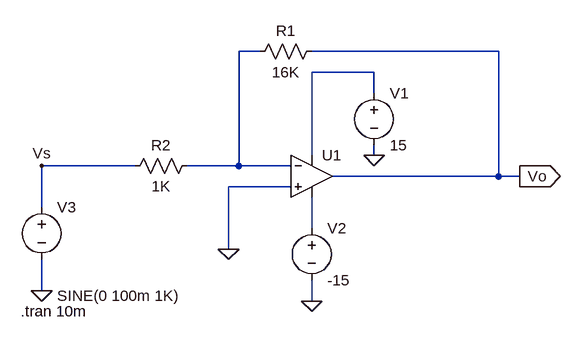
[diagram p0: schematic Run_1_A.asc]
Run_1_A.asc, the LTspice schematic file:
Version 4
SHEET 1 880 680
WIRE 192 0 160 0
WIRE 560 0 272 0
WIRE 368 32 272 32
WIRE 368 64 368 32
WIRE 272 160 272 32
WIRE 368 160 368 144
WIRE 0 176 -144 176
WIRE 160 176 160 0
WIRE 160 176 80 176
WIRE 240 176 160 176
WIRE 560 192 560 0
WIRE 560 192 304 192
WIRE 592 192 560 192
WIRE 240 208 144 208
WIRE -144 240 -144 176
WIRE 272 272 272 224
WIRE 144 304 144 208
WIRE -144 368 -144 320
WIRE 272 384 272 352
FLAG 144 304 0
FLAG -144 368 0
FLAG -144 176 Vs
FLAG 368 160 0
FLAG 272 384 0
FLAG 592 192 Vo
IOPIN 592 192 Out
SYMBOL OpAmps\\UniversalOpamp2 272 192 R0
SYMATTR InstName U1
SYMBOL res 288 -16 R90
WINDOW 0 0 56 VBottom 2
WINDOW 3 32 56 VTop 2
SYMATTR InstName R1
SYMATTR Value 16K
SYMBOL res 96 160 R90
WINDOW 0 0 56 VBottom 2
WINDOW 3 32 56 VTop 2
SYMATTR InstName R2
SYMATTR Value 1K
SYMBOL voltage -144 224 R0
WINDOW 3 24 152 Left 2
WINDOW 123 24 124 Left 2
WINDOW 39 0 0 Left 0
SYMATTR Value SINE(0 100m 1K)
SYMATTR InstName V3
SYMBOL voltage 368 48 R0
WINDOW 123 0 0 Left 0
WINDOW 39 0 0 Left 0
SYMATTR InstName V1
SYMATTR Value 15
SYMBOL voltage 272 256 R0
WINDOW 123 0 0 Left 0
WINDOW 39 0 0 Left 0
SYMATTR InstName V2
SYMATTR Value -15
TEXT -176 400 Left 2 !.tran 10m

The netlist it stands for:
* Run_1_A.asc
XU1 0 N001 N002 N003 Vo level.2 Avol=1Meg GBW=10Meg Slew=10Meg ilimit=25m rail=0 Vos=0 phimargin=45 en=0 enk=0 in=0 ink=0 Rin=500Meg  ; pins IN+ IN- V+ V- OUT
R1 Vo N001 16K
R2 N001 Vs 1K
V3 Vs 0 SINE(0 100m 1K)
V1 N002 0 15
V2 N003 0 -15
.tran 10m
.lib UniversalOpamps2.sub
.backanno
.end